# EasyEDA Pro project PCB_keyboard_V1_3_4.eprj

# Schematic PCB_keyboard
Board Name: PCB_keyboard; Create Date: 2025-07-02; Page Name: Sheet_1; Project Name: PCB_keyboard_V1_3_3; Schematic Name: PCB_keyboard; Update Date: 2025-07-06; Add into BOM: yes; Company: Your Company; Convert to PCB: yes; Date: 2025-05-16; REV: 1.0; Sheet: 1/1; spicePre: .
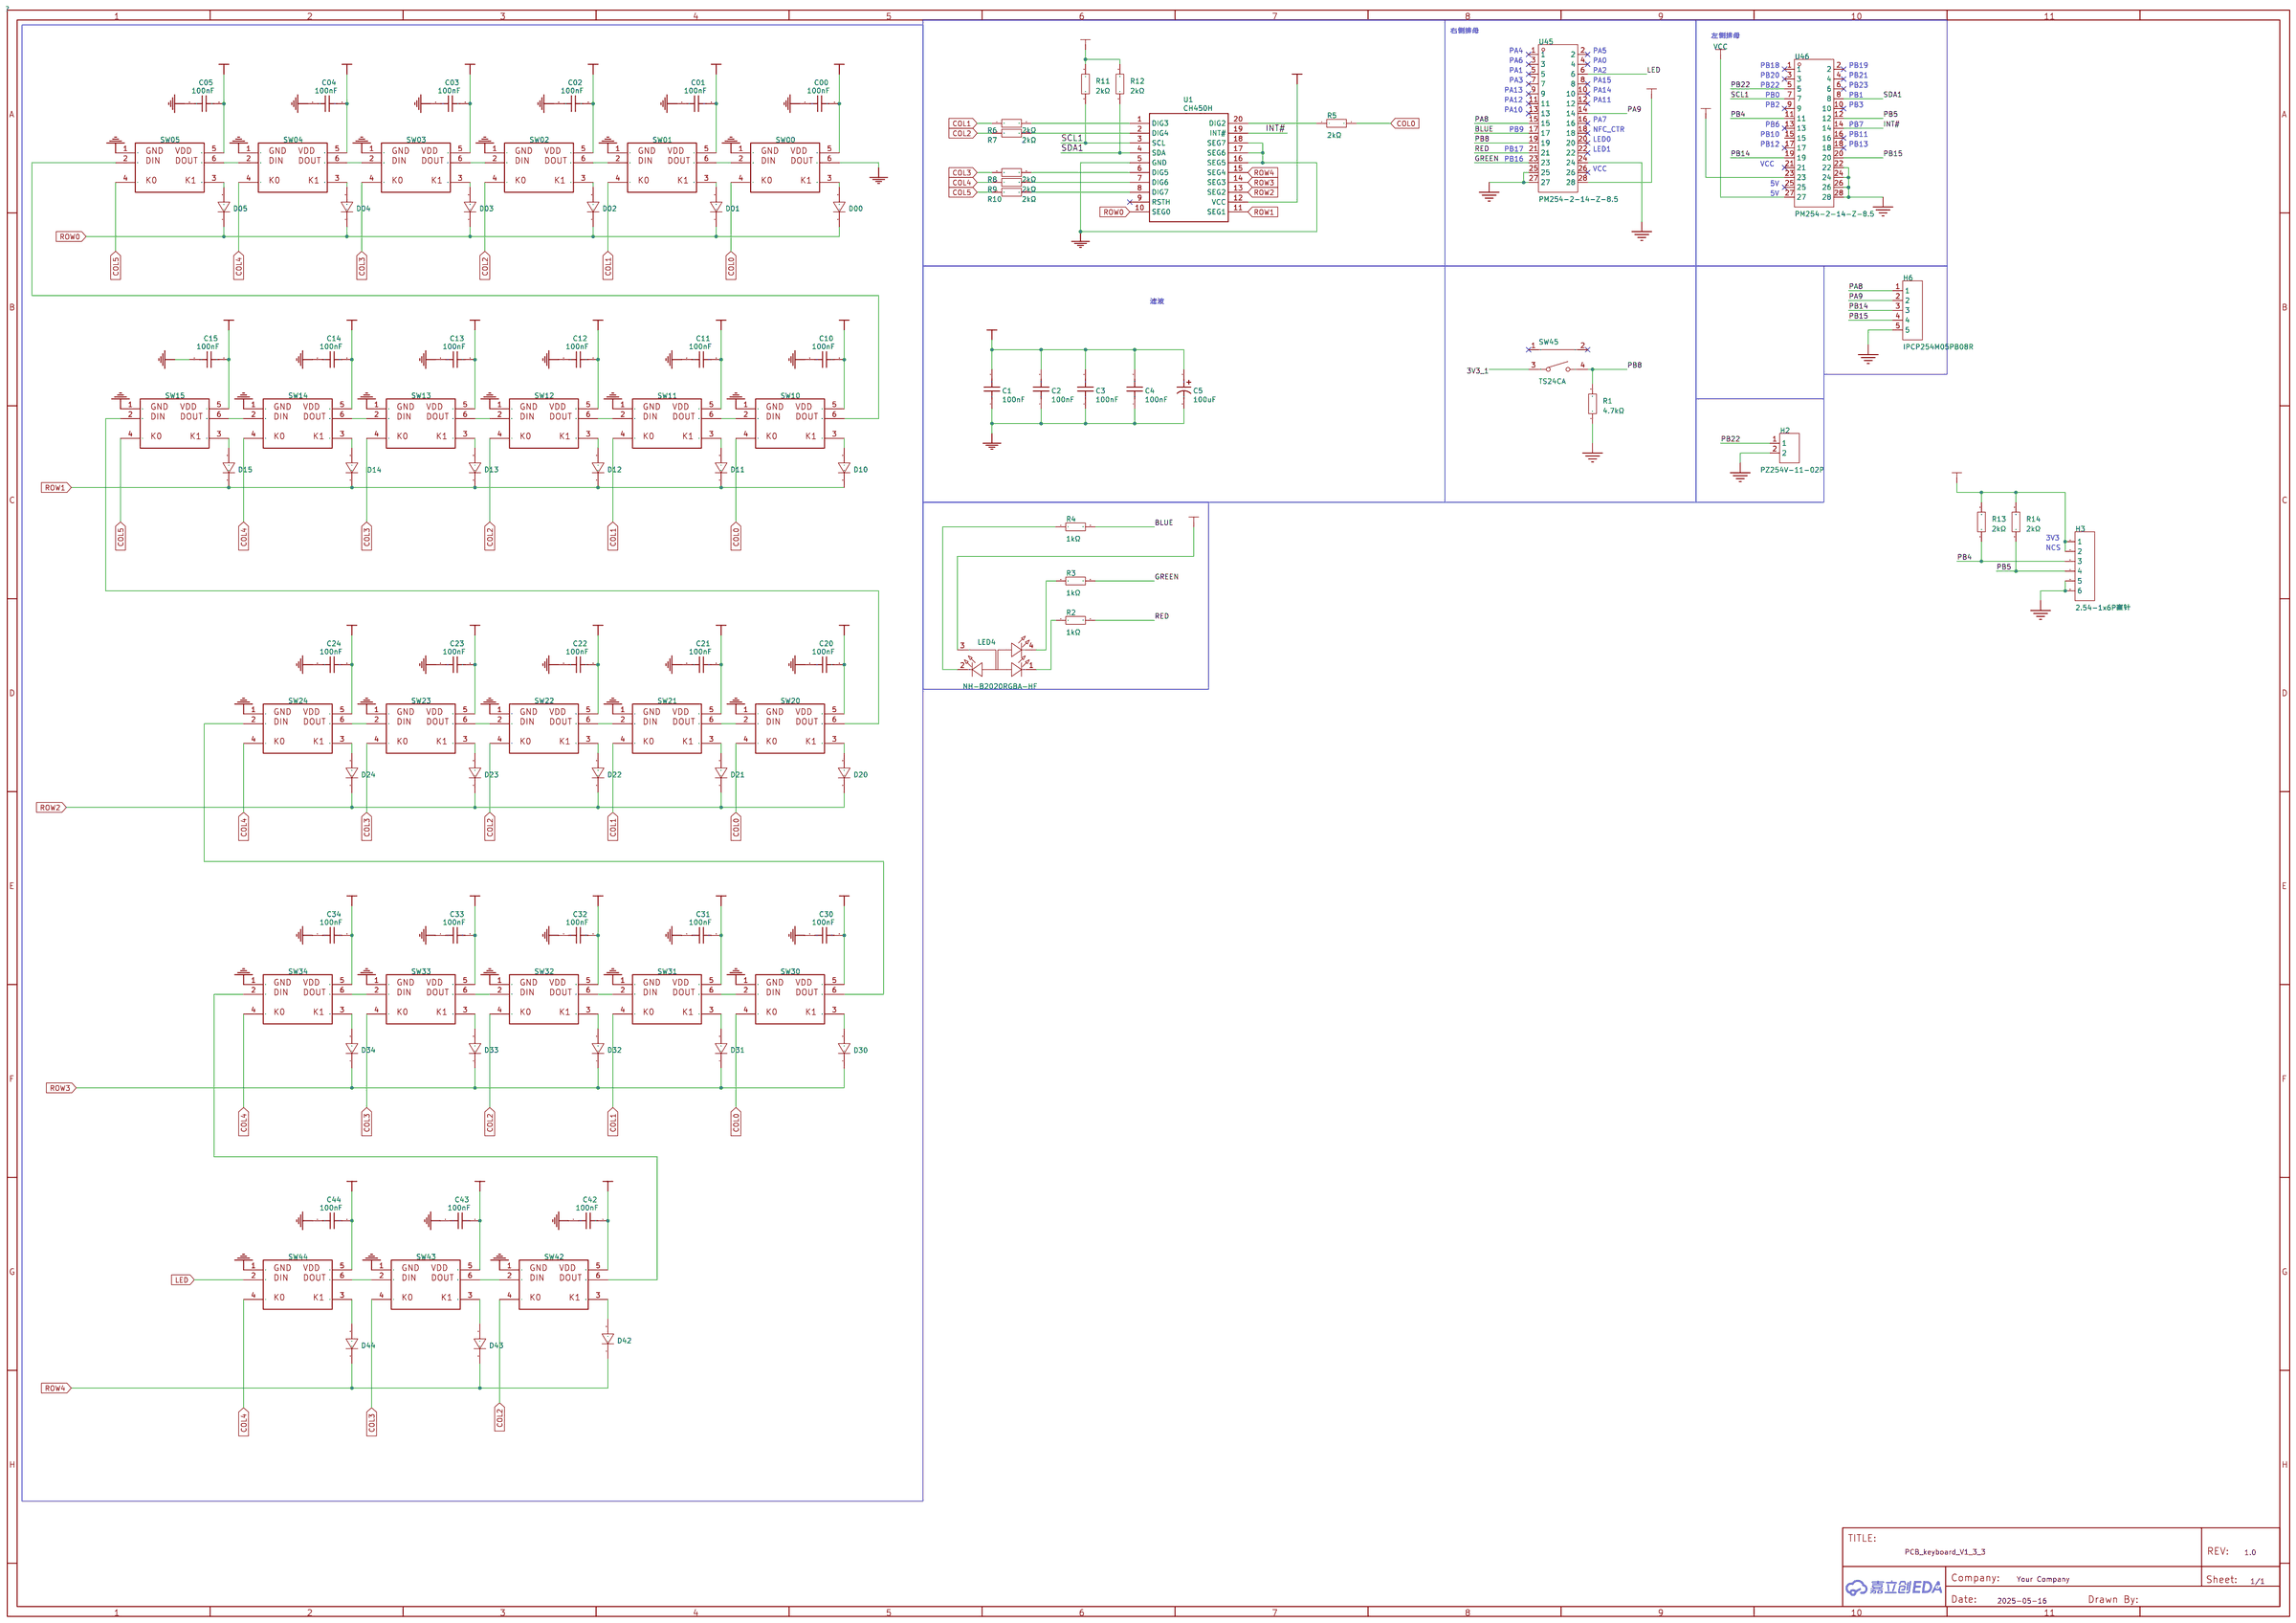
[diagram p0: schematic sheet]

## Parts
C00  100nF  [C0805]
C1  100nF  [C0805]
C01  100nF  [C0805]
C2  100nF  [C0805]
C02  100nF  [C0805]
C3  100nF  [C0805]
C03  100nF  [C0805]
C4  100nF  [C0805]
C04  100nF  [C0805]
C5  100uF  [CAP-TH_BD6.0-P2.50-D0.5-FD]
C05  100nF  [C0805]
C10  100nF  [C0805]
C11  100nF  [C0805]
C12  100nF  [C0805]
C13  100nF  [C0805]
C14  100nF  [C0805]
C15  100nF  [C0805]
C20  100nF  [C0805]
C21  100nF  [C0805]
C22  100nF  [C0805]
C23  100nF  [C0805]
C24  100nF  [C0805]
C30  100nF  [C0805]
C31  100nF  [C0805]
C32  100nF  [C0805]
C33  100nF  [C0805]
C34  100nF  [C0805]
C42  100nF  [C0805]
C43  100nF  [C0805]
C44  100nF  [C0805]
D00  1N4148W  [SOD-123_L2.8-W1.8-LS3.7-RD]
D01  1N4148W  [SOD-123_L2.8-W1.8-LS3.7-RD]
D02  1N4148W  [SOD-123_L2.8-W1.8-LS3.7-RD]
D03  1N4148W  [SOD-123_L2.8-W1.8-LS3.7-RD]
D04  1N4148W  [SOD-123_L2.8-W1.8-LS3.7-RD]
D05  1N4148W  [SOD-123_L2.8-W1.8-LS3.7-RD]
D10  1N4148W  [SOD-123_L2.8-W1.8-LS3.7-RD]
D11  1N4148W  [SOD-123_L2.8-W1.8-LS3.7-RD]
D12  1N4148W  [SOD-123_L2.8-W1.8-LS3.7-RD]
D13  1N4148W  [SOD-123_L2.8-W1.8-LS3.7-RD]
D14  1N4148W  [SOD-123_L2.8-W1.8-LS3.7-RD]
D15  1N4148W  [SOD-123_L2.8-W1.8-LS3.7-RD]
D20  1N4148W  [SOD-123_L2.8-W1.8-LS3.7-RD]
D21  1N4148W  [SOD-123_L2.8-W1.8-LS3.7-RD]
D22  1N4148W  [SOD-123_L2.8-W1.8-LS3.7-RD]
D23  1N4148W  [SOD-123_L2.8-W1.8-LS3.7-RD]
D24  1N4148W  [SOD-123_L2.8-W1.8-LS3.7-RD]
D30  1N4148W  [SOD-123_L2.8-W1.8-LS3.7-RD]
D31  1N4148W  [SOD-123_L2.8-W1.8-LS3.7-RD]
D32  1N4148W  [SOD-123_L2.8-W1.8-LS3.7-RD]
D33  1N4148W  [SOD-123_L2.8-W1.8-LS3.7-RD]
D34  1N4148W  [SOD-123_L2.8-W1.8-LS3.7-RD]
D42  1N4148W  [SOD-123_L2.8-W1.8-LS3.7-RD]
D43  1N4148W  [SOD-123_L2.8-W1.8-LS3.7-RD]
D44  1N4148W  [SOD-123_L2.8-W1.8-LS3.7-RD]
H2  PZ254V-11-02P  [HDR-TH_2P-P2.54-V-M]
H3  2.54-1x6P直针  [HDR-TH_6P-P2.54-V-M-1]
H6  IPCP254M05PB08R  [HDR-TH_IPCP254M05PB08R]
LED4  NH-B2020RGBA-HF  [LED-ARRAY-SMD_4P-L2.1-W2.1-TL_NH-B2020RGBA]
R1  4.7kΩ  [R0805]
R2  1kΩ  [R0805]
R3  1kΩ  [R0805]
R4  1kΩ  [R0805]
R5  2kΩ  [R0805]
R6  2kΩ  [R0805]
R7  2kΩ  [R0805]
R8  2kΩ  [R0805]
R9  2kΩ  [R0805]
R10  2kΩ  [R0805]
R11  2kΩ  [R0805]
R12  2kΩ  [R0805]
R13  2kΩ  [R0805]
R14  2kΩ  [R0805]
SW00  凯华轴座+3528反贴灯 COPY  [凯华轴座+3528反贴灯]
SW01  凯华轴座+3528反贴灯 COPY  [凯华轴座+3528反贴灯]
SW02  凯华轴座+3528反贴灯 COPY  [凯华轴座+3528反贴灯]
SW03  凯华轴座+3528反贴灯 COPY  [凯华轴座+3528反贴灯]
SW04  凯华轴座+3528反贴灯 COPY  [凯华轴座+3528反贴灯]
SW05  凯华轴座+3528反贴灯 COPY  [凯华轴座+3528反贴灯]
SW10  凯华轴座+3528反贴灯 COPY  [凯华轴座+3528反贴灯]
SW11  凯华轴座+3528反贴灯 COPY  [凯华轴座+3528反贴灯]
SW12  凯华轴座+3528反贴灯 COPY  [凯华轴座+3528反贴灯]
SW13  凯华轴座+3528反贴灯 COPY  [凯华轴座+3528反贴灯]
SW14  凯华轴座+3528反贴灯 COPY  [凯华轴座+3528反贴灯]
SW15  凯华轴座+3528反贴灯 COPY  [凯华轴座+3528反贴灯]
SW20  凯华轴座+3528反贴灯 COPY  [凯华轴座+3528反贴灯]
SW21  凯华轴座+3528反贴灯 COPY  [凯华轴座+3528反贴灯]
SW22  凯华轴座+3528反贴灯 COPY  [凯华轴座+3528反贴灯]
SW23  凯华轴座+3528反贴灯 COPY  [凯华轴座+3528反贴灯]
SW24  凯华轴座+3528反贴灯 COPY  [凯华轴座+3528反贴灯]
SW30  凯华轴座+3528反贴灯 COPY  [凯华轴座+3528反贴灯]
SW31  凯华轴座+3528反贴灯 COPY  [凯华轴座+3528反贴灯]
SW32  凯华轴座+3528反贴灯 COPY  [凯华轴座+3528反贴灯]
SW33  凯华轴座+3528反贴灯 COPY  [凯华轴座+3528反贴灯]
SW34  凯华轴座+3528反贴灯 COPY  [凯华轴座+3528反贴灯]
SW42  凯华轴座+3528反贴灯 COPY  [凯华轴座+3528反贴灯]
SW43  凯华轴座+3528反贴灯 COPY  [凯华轴座+3528反贴灯]
SW44  凯华轴座+3528反贴灯 COPY  [凯华轴座+3528反贴灯]
SW45  TS24CA  [SW-SMD_TS24CA]
U1  CH450H  [SOP-20_L12.7-W7.5-P1.27-LS10.3-BL]
U45  PM254-2-14-Z-8.5  [HDR-TH_28P-P2.54-V-F-R2-C14-S2.54-1]
U46  PM254-2-14-Z-8.5  [HDR-TH_28P-P2.54-V-F-R2-C14-S2.54-1]

## Library data of the parts
C00 C1 C01 C2 C02 C3 C03 C4 C04 C05 C10-C15 C20-C24 C30-C34 C42-C44 = FCC0805B104K500DT: 容值:100nF;精度:±10%;额定电压:50V;温度系数:X7R;; LCSC Part Name: 100nF ±10% 50V; Supplier Part: C5137467; Manufacturer: FOJAN(富捷); Supplier Footprint: 0805; JLCPCB Part Class: Extended Part; Datasheet: https://atta.szlcsc.com/upload/public/pdf/source/20220818/0EB3B7FB2F5648AC16609637FBA7DABE.pdf; Supplier: LCSC; Tolerance: ±10%; Voltage Rating: 50V; Temperature Coefficient: X7R
C5 = 100uF: Supplier: LCSC; Supplier Part: C2873969; Manufacturer: ROQANG(容强); Manufacturer Part: KM1E101M0611; link: https://so.szlcsc.com/global.html?k=C2873969&ref=editor; nameAlias: Value; Contributor: lcsc; spicePre: C; spiceSymbolName: KM1E101M0611
D00 D01 D02 D03 D04 D05 D10-D15 D20-D24 D30-D34 D42-D44 = 1N4148W_C2099: 二极管配置:独立式;正向压降(Vf):1.25V@150mA;直流反向耐压(Vr):100V;整流电流:150mA;反向恢复时间(trr):4ns;; LCSC Part Name: 丝印T4; Supplier Part: C2099; Manufacturer: CJ(江苏长电/长晶); Supplier Footprint: SOD-123; JLCPCB Part Class: Extended Part; Datasheet: https://atta.szlcsc.com/upload/public/pdf/source/20120428/1457706480199.pdf; Supplier: LCSC; Diode Configuration: 独立式; Forward Voltage (Vf@If): 1.25V@150mA; Reverse Voltage (Vr): 100V; Rectified Current: 150mA; Reverse Leakage Current: 1uA@75V; Reverse Recovery Time (trr): 4ns
H2 = PZ254V-11-02P: 插针结构:1x2P;间距:2.54mm;行距:-;圆针/方针:方针;安装方式:直插;排数:单排;总PIN位数:2P;额定电流:-;额定电压:-;配合针长度:6mm;塑高:2.5mm;端接针长度:3mm;触头材质:黄铜;触头镀层:-;工作温度:-40℃~+105℃;颜色:黑色;; LCSC Part Name: 1x2P 间距:2.54mm 方针 直插; Supplier Part: C492401; Manufacturer: XFCN(兴飞); Supplier Footprint: 插件,P=2.54mm; JLCPCB Part Class: 扩展库; Datasheet: https://atta.szlcsc.com/upload/public/pdf/source/20200309/C492401_A812433581A9B211A7FFA413ADDFF0E5.pdf; Supplier: LCSC; Pin Structure: 1x2P; Pitch: 2.54mm; Circluar Pins/Square Pins: 方针; Mounting Type: 直插; Number of Rows: 单排; Number of Pins: 2P; Length of Mating Pin: 6mm; Insulation Height: 2.5mm; Length of End Connection Pin: 3mm; Contact Material: 黄铜; Operating Temperature: -40℃~+105℃; Color: 黑色
H3 = 2.54-1x6P直针: 插针结构:1x6P;间距:2.54mm;行距:-;圆针/方针:方针;安装方式:直插;排数:单排;总PIN位数:6P;额定电流:3A;额定电压:-;配合针长度:-;塑高:-;触头材质:黄铜;触头镀层:-;工作温度:-40℃~+105℃;颜色:黑色;; LCSC Part Name: 1x6P 间距:2.54mm 方针 直插; Supplier Part: C37208; Manufacturer: BOOMELE(博穆精密); Supplier Footprint: 插件,P=2.54mm; JLCPCB Part Class: 扩展库; Datasheet: https://atta.szlcsc.com/upload/public/pdf/source/20250115/42A019761A40C8B839643401D8CA5A96.pdf; Supplier: LCSC; Pin Structure: 1x6P; Pitch: 2.54mm; Circluar Pins/Square Pins: 方针; Mounting Type: 直插; Number of Rows: 单排; Number of Pins: 6P; Current Rating: 3A; Contact Material: 黄铜; Operating Temperature: -40℃~+105℃; Color: 黑色
H6 = IPCP254M05PB08R: 插针结构:1x5P;间距:2.54mm;圆针/方针:方针;安装方式:弯插;排数:单排;总PIN位数:5P;额定电流:3A;额定电压:-;塑高:2.5mm;触头材质:黄铜;触头镀层:金;工作温度:-40℃~+105℃;颜色:黑色;; LCSC Part Name: 1x5P 间距:2.54mm 方针 弯插; Supplier Part: C22395595; Manufacturer: INCP; Supplier Footprint: 弯插,P=2.54mm; JLCPCB Part Class: 扩展库; Datasheet: https://atta.szlcsc.com/upload/public/pdf/source/20250208/975C7ED3E6965D9726D213BB1A1DEC82.pdf; Supplier: LCSC; Pin Structure: 1x5P; Pitch: 2.54mm; Circluar Pins/Square Pins: 方针; Mounting Type: 弯插; Number of Rows: 单排; Number of Pins: 5P; Current Rating: 3A; Insulation Height: 2.5mm; Contact Material: 黄铜; Contact Plating: 金; Operating Temperature: -40℃~+105℃; Color: 黑色
LED4 = NH-B2020RGBA-HF: 黑色哑光户外RGB; Supplier Part: C2874116; Manufacturer: 国星光电; Supplier Footprint: SMD,2.1x2.1mm; JLCPCB Part Class: 扩展库; Datasheet: https://atta.szlcsc.com/upload/public/pdf/source/20210810/F2CC95523506BC87574AF0308E7F77A3.pdf; Supplier: LCSC; Diode Configuration: 共阳极; Dominant Wavelength: G:525nm；R:622nm；B:468nm; Luminous Intensity: R:45mcd；G:160mcd；B:25mcd; Viewing Angle: 110°; Forward Current: R:8mA；G:5mA；B:3mA; Forward Voltage: R:2V；G:2.7V；B:2.8V; Installation Method: 正贴; Operating Temperature: -30℃~+85℃
R1 = 0805W8F4701T5E: 电阻类型:厚膜电阻;阻值:4.7kΩ;精度:±1%;功率:125mW;最大工作电压:150V;温度系数:±100ppm/℃;; LCSC Part Name: 4.7kΩ ±1% 125mW 厚膜电阻; Supplier Part: C17673; Manufacturer: UNI-ROYAL(厚声); Supplier Footprint: 0805; JLCPCB Part Class: Basic Part; Datasheet: https://atta.szlcsc.com/upload/public/pdf/source/20200306/C422600_1E6D84923E4A46A82E41ADD87F860B5C.pdf; Supplier: LCSC; Type: 厚膜电阻; Tolerance: ±1%; Power(Watts): 125mW; Overload Voltage (Max): 150V; Temperature Coefficient: ±100ppm/℃; Operating Temperature Range: -55℃~+155℃
R2-R4 = 0805W8F1001T5E: 电阻类型:厚膜电阻;阻值:1kΩ;精度:±1%;功率:125mW;最大工作电压:150V;温度系数:±100ppm/℃;; LCSC Part Name: 1kΩ ±1% 125mW 厚膜电阻; Supplier Part: C17513; Manufacturer: UNI-ROYAL(厚声); Supplier Footprint: 0805; JLCPCB Part Class: Basic Part; Datasheet: https://atta.szlcsc.com/upload/public/pdf/source/20200306/C422600_1E6D84923E4A46A82E41ADD87F860B5C.pdf; Supplier: LCSC; Type: 厚膜电阻; Tolerance: ±1%; Power(Watts): 125mW; Overload Voltage (Max): 150V; Temperature Coefficient: ±100ppm/℃; Operating Temperature Range: -55℃~+155℃
R5-R14 = 0805W8F2001T5E: 电阻类型:厚膜电阻;阻值:2kΩ;精度:±1%;功率:125mW;最大工作电压:150V;温度系数:±100ppm/℃;; LCSC Part Name: 2kΩ ±1% 125mW 厚膜电阻; Supplier Part: C17604; Manufacturer: UNI-ROYAL(厚声); Supplier Footprint: 0805; JLCPCB Part Class: 基础库; Datasheet: https://atta.szlcsc.com/upload/public/pdf/source/20200306/C422600_1E6D84923E4A46A82E41ADD87F860B5C.pdf; Supplier: LCSC; Type: 厚膜电阻; Tolerance: ±1%; Power(Watts): 125mW; Overload Voltage (Max): 150V; Temperature Coefficient: ±100ppm/℃; Operating Temperature Range: -55℃~+155℃
SW00 SW01 SW02 SW03 SW04 SW05 SW10-SW15 SW20-SW24 SW30-SW34 SW42-SW44 = 凯华轴座+3528反贴灯 COPY
SW45 = TS24CA: 电路结构:单刀单掷;按钮形状:矩形按钮;安装方式:卧贴;开关长度:4.55mm;开关宽度:1.8mm;开关高度:3.5mm;触点电流:50mA;额定电压(DC):12V;带灯:-;机械寿命:-;; LCSC Part Name: 4.55*1.8*3.5mm 卧贴 轻触开关; Supplier Part: C393942; Manufacturer: SHOU HAN(首韩); Supplier Footprint: SMD; JLCPCB Part Class: 扩展库; Datasheet: https://atta.szlcsc.com/upload/public/pdf/source/20190521/C393942_591A9E318887EFA4274D34029981AD99.pdf; Supplier: LCSC; Circuit: 单刀单掷; Actuator Style: 矩形按钮; Mounting Style: 卧贴; Switch Length: 4.55mm; Switch Width: 1.8mm; Switch Height: 3.5mm; Contact Current: 50mA; Voltage Rating (DC): 12V
U1 = CH450H: Supplier: LCSC; Manufacturer: WCH(南京沁恒); Supplier Part: C56245; JLCPCB Part Class: Extended Part; spicePre: U
U45 U46 = PM254-2-14-Z-8.5: 插孔结构:2x14P;间距:2.54mm;行距:2.54mm;圆孔/方孔:方孔;安装类型:直插;排数:双排;总孔位数:28P;额定电流:3A;额定电压:-;插孔方向:顶部;塑高:8.5mm;触头材质:铜合金;工作温度范围:-40℃~+105℃;焊接温度(最大值):260℃@5S;; LCSC Part Name: 2x14P 间距:2.54mm 直插; Supplier Part: C2897415; Manufacturer: HCTL(华灿天禄); Supplier Footprint: 插件,P=2.54mm; JLCPCB Part Class: 扩展库; Datasheet: https://atta.szlcsc.com/upload/public/pdf/source/20230609/3D36CA2C1BFC9FD1C3F709AD9DFEB9C2.pdf; Supplier: LCSC; Holes Structure: 2x14P; Pitch: 2.54mm; Row Spacing: 2.54mm; Circular Hole / Square Hole: 方孔; Mounting Type: 直插; Number of Rows: 双排; Number of Holes: 28P; Current Rating (Max): 3A; Holes Direction: 顶部; Insulation Height: 8.5mm; Contact Material: 铜合金; Operating Temperature Range: -40℃~+105℃; Soldering Temperature(Max): 260℃@5S

## Nets
3V3_1: LED4.3(+) SW45.3 U45.28
3V3_2: H3.1 H3.2 R11.2 R12.2 R13.2 R14.2 U46.23
GND: C00.1 C1.1 C01.1 C2.1 C02.1 C3.1 C03.1 C4.1 C04.1 C05.1 C5.2 C10.1 C11.1 C12.1 C13.1 C14.1 C15.1 C20.1 C21.1 C22.1 C23.1 C24.1 C30.1 C31.1 C32.1 C33.1 C34.1 C42.1 C43.1 C44.1 H2.2 H3.5 H3.6 H6.5 R1.1 SW00.1 SW00.6 SW01.1 SW02.1 SW03.1 SW04.1 SW05.1 SW10.1 SW11.1 SW12.1 SW13.1 SW14.1 SW15.1 SW20.1 SW21.1 SW22.1 SW23.1 SW24.1 SW30.1 SW31.1 SW32.1 SW33.1 SW34.1 SW42.1 SW43.1 SW44.1 U1.5(GND) U1.16(SEG5) U1.17(SEG6) U1.18(SEG7) U45.24 U45.25 U45.27 U46.22 U46.24 U46.26 U46.28
VCC: C00.2 C1.2 C01.2 C2.2 C02.2 C3.2 C03.2 C4.2 C04.2 C5.1 C05.2 C10.2 C11.2 C12.2 C13.2 C14.2 C15.2 C20.2 C21.2 C22.2 C23.2 C24.2 C30.2 C31.2 C32.2 C33.2 C34.2 C42.2 C43.2 C44.2 SW00.5 SW01.5 SW02.5 SW03.5 SW04.5 SW05.5 SW10.5 SW11.5 SW12.5 SW13.5 SW14.5 SW15.5 SW20.5 SW21.5 SW22.5 SW23.5 SW24.5 SW30.5 SW31.5 SW32.5 SW33.5 SW34.5 SW42.5 SW43.5 SW44.5 U1.12(VCC) U46.27
BLUE: R4.2 U45.17
COL0: R5.2 SW00.4 SW10.4 SW20.4 SW30.4
COL1: R6.1 SW01.4 SW11.4 SW21.4 SW31.4
COL2: R7.1 SW02.4 SW12.4 SW22.4 SW32.4 SW42.4
COL3: R8.1 SW03.4 SW13.4 SW23.4 SW33.4 SW43.4
COL4: R9.1 SW04.4 SW14.4 SW24.4 SW34.4 SW44.4
COL5: R10.1 SW05.4 SW15.4
GREEN: R3.2 U45.23
INT#: U1.19(INT#) U46.14
LED: SW44.2 U45.6
PA8: H6.1 U45.15
PA9: H6.2 U45.14
PB4: H3.3 R13.1 U46.11
PB5: H3.4 R14.1 U46.12
PB8: R1.2 SW45.4 U45.19
PB14: H6.3 U46.19
PB15: H6.4 U46.20
PB22: H2.1 U46.5
RED: R2.2 U45.21
ROW0: D00.1(K) D01.1(K) D02.1(K) D03.1(K) D04.1(K) D05.1(K) U1.10(SEG0)
ROW1: D10.1(K) D11.1(K) D12.1(K) D13.1(K) D14.1(K) D15.1(K) U1.11(SEG1)
ROW2: D20.1(K) D21.1(K) D22.1(K) D23.1(K) D24.1(K) U1.13(SEG2)
ROW3: D30.1(K) D31.1(K) D32.1(K) D33.1(K) D34.1(K) U1.14(SEG3)
ROW4: D42.1(K) D43.1(K) D44.1(K) U1.15(SEG4)
SCL1: R11.1 U1.3(SCL) U46.7
SDA1: R12.1 U1.4(SDA) U46.8
$1N69: D00.2(A) SW00.3
$1N70: D01.2(A) SW01.3
$1N71: D02.2(A) SW02.3
$1N72: D03.2(A) SW03.3
$1N73: D04.2(A) SW04.3
$1N74: D05.2(A) SW05.3
$1N77: D10.2(A) SW10.3
$1N78: D11.2(A) SW11.3
$1N79: D12.2(A) SW12.3
$1N80: D13.2(A) SW13.3
$1N81: D14.2(A) SW14.3
$1N82: D15.2(A) SW15.3
$1N83: D20.2(A) SW20.3
$1N84: D21.2(A) SW21.3
$1N85: D22.2(A) SW22.3
$1N86: D23.2(A) SW23.3
$1N87: D24.2(A) SW24.3
$1N90: D30.2(A) SW30.3
$1N91: D31.2(A) SW31.3
$1N92: D32.2(A) SW32.3
$1N95: D33.2(A) SW33.3
$1N97: D34.2(A) SW34.3
$1N99: D42.2(A) SW42.3
$1N100: D43.2(A) SW43.3
$1N101: D44.2(A) SW44.3
$1N102: SW42.2 SW43.6
$1N103: SW43.2 SW44.6
$1N108: SW34.2 SW42.6
$1N109: SW33.2 SW34.6
$1N110: SW32.2 SW33.6
$1N111: SW31.2 SW32.6
$1N112: SW30.2 SW31.6
$1N113: SW24.2 SW30.6
$1N114: SW23.2 SW24.6
$1N115: SW22.2 SW23.6
$1N116: SW21.2 SW22.6
$1N117: SW20.2 SW21.6
$1N118: SW15.2 SW20.6
$1N119: SW14.2 SW15.6
$1N120: SW13.2 SW14.6
$1N121: SW12.2 SW13.6
$1N122: SW11.2 SW12.6
$1N123: SW10.2 SW11.6
$1N125: SW04.2 SW05.6
$1N126: SW03.2 SW04.6
$1N127: SW02.2 SW03.6
$1N128: SW01.2 SW02.6
$1N129: SW00.2 SW01.6
$1N130: SW05.2 SW10.6
$1N70752: R5.1 U1.20(DIG2)
$1N70795: R6.2 U1.1(DIG3)
$1N70838: R7.2 U1.2(DIG4)
$1N70881: R8.2 U1.6(DIG5)
$1N70924: R9.2 U1.7(DIG6)
$1N70967: R10.2 U1.8(DIG7)
$1N82980: LED4.1(-) R2.1
$1N82986: LED4.4(-) R3.1
$1N82993: LED4.2(-) R4.1

Not connected (* = marked no-connect by the designer): SW45 1* 2*; U1 9(RSTH)*; U45 1* 2* 3* 4* 5* 7* 8* 9* 10* 11* 12* 13* 16* 18* 20* 22* 26*; U46 1* 2* 3* 4* 6* 9* 10* 13* 15 16* 17* 18* 21* 25*

## Notes on the sheet
- 右侧排母
- 左侧排母
- PA4
- PA5
- PA6
- PA0
- PB18
- PB19
- PA1
- PA3
- PA15
- PA2
- PB20
- PB21
- PA13
- PA14
- PB22
- PB23
- PA12
- PA11
- PB0
- PB2
- PB1
- PB3
- PA10
- PA7
- PB6
- PB7
- PB9
- LED0
- NFC_CTR
- PB10
- PB11
- PB17
- LED1
- PB12
- PB13
- PB16
- VCC
- VCC
- 5V
- 5V
- 滤波
- 3V3
- NCS

# Board PCB_PCB_keyboard
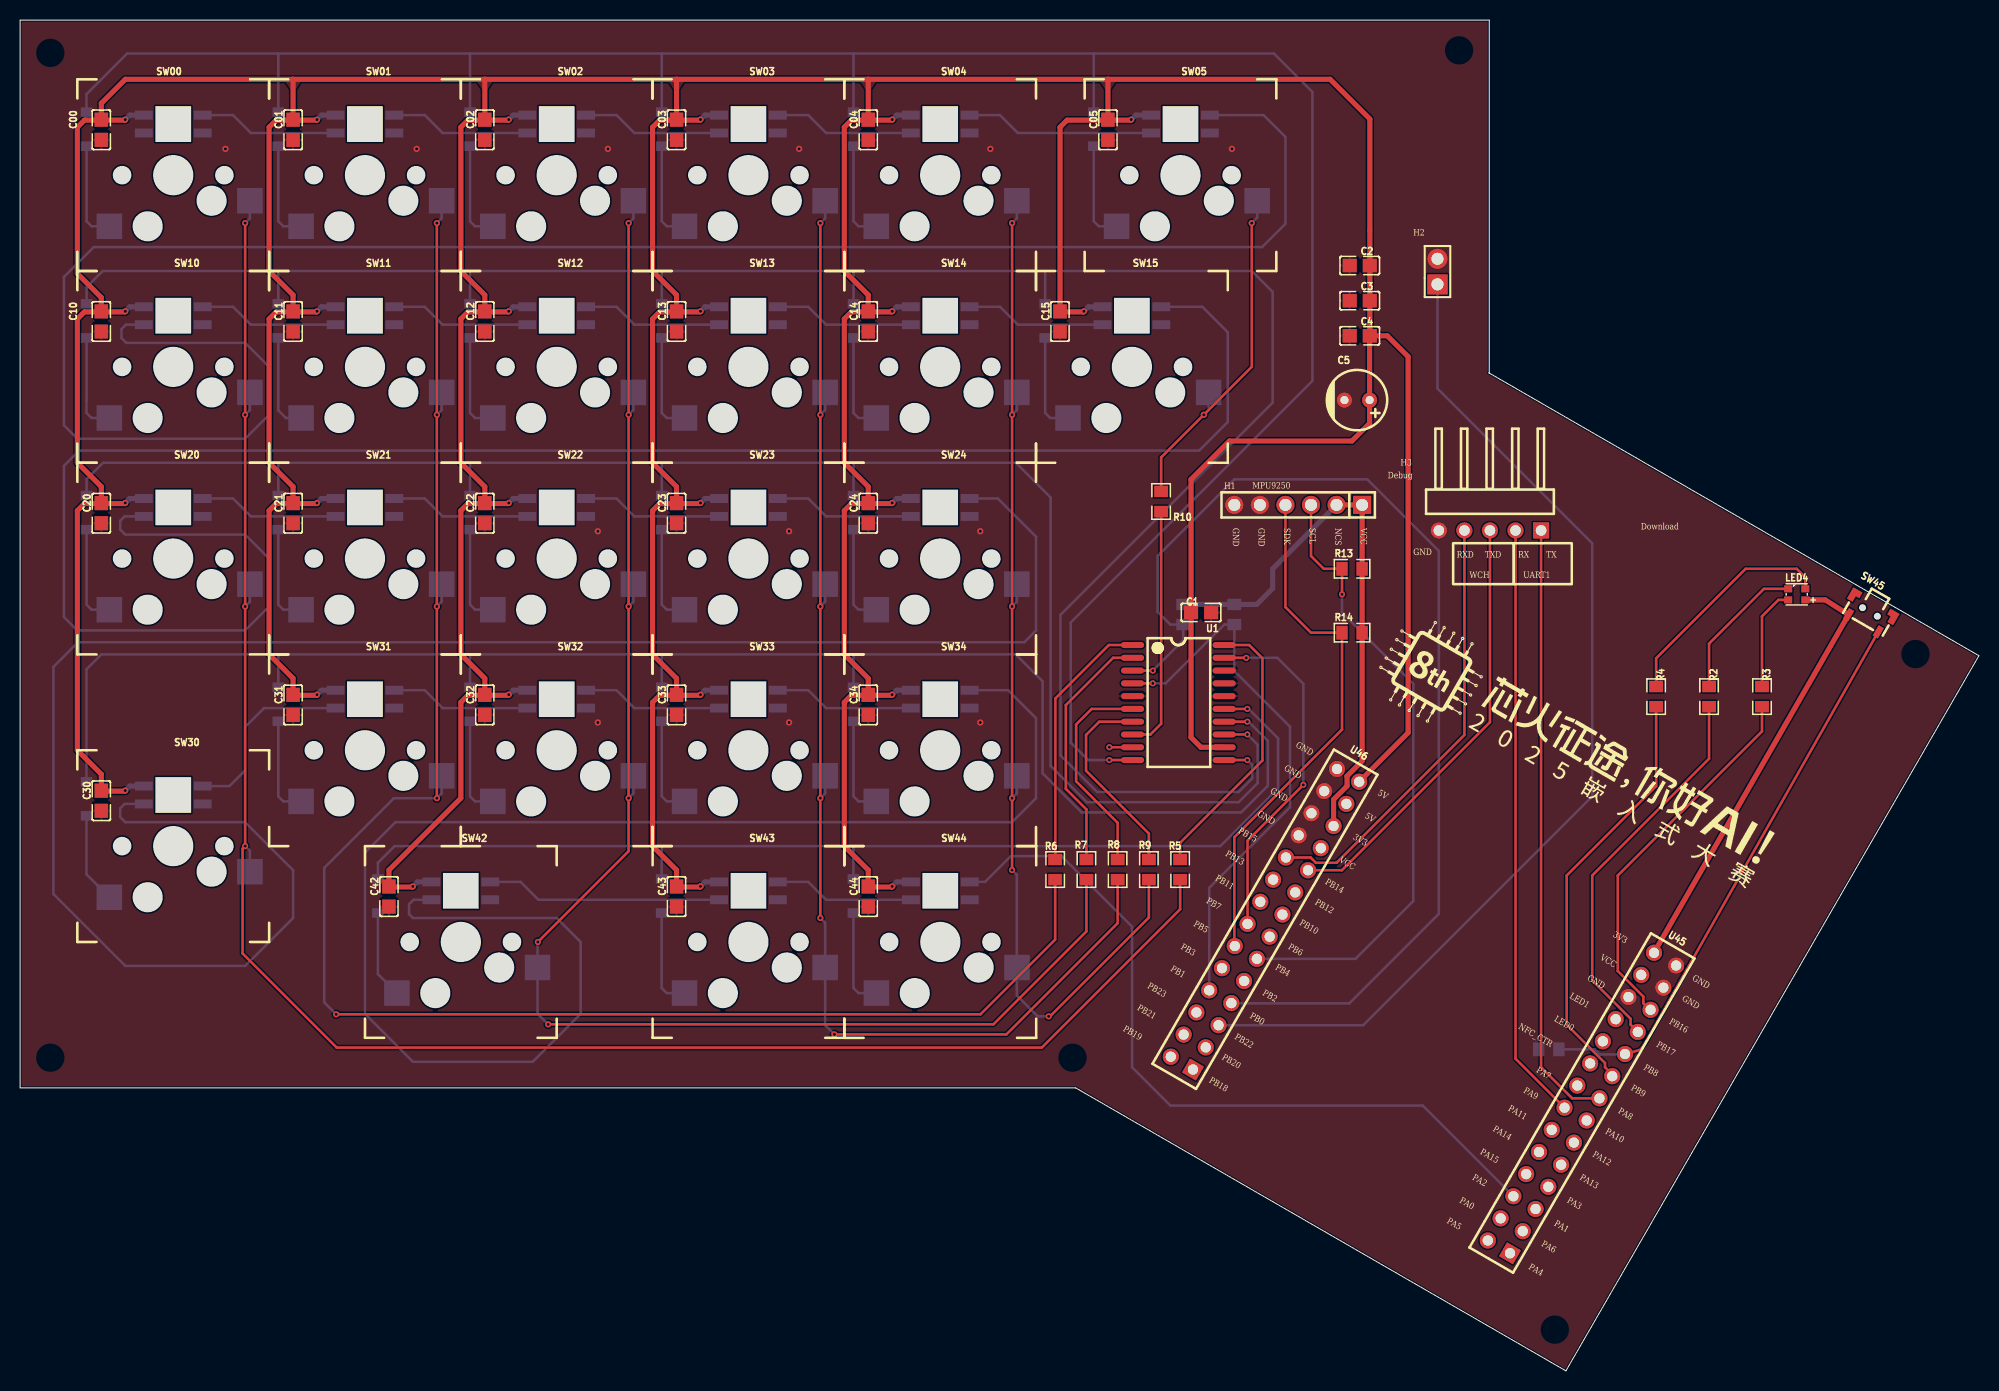
[diagram p1: board, top side]
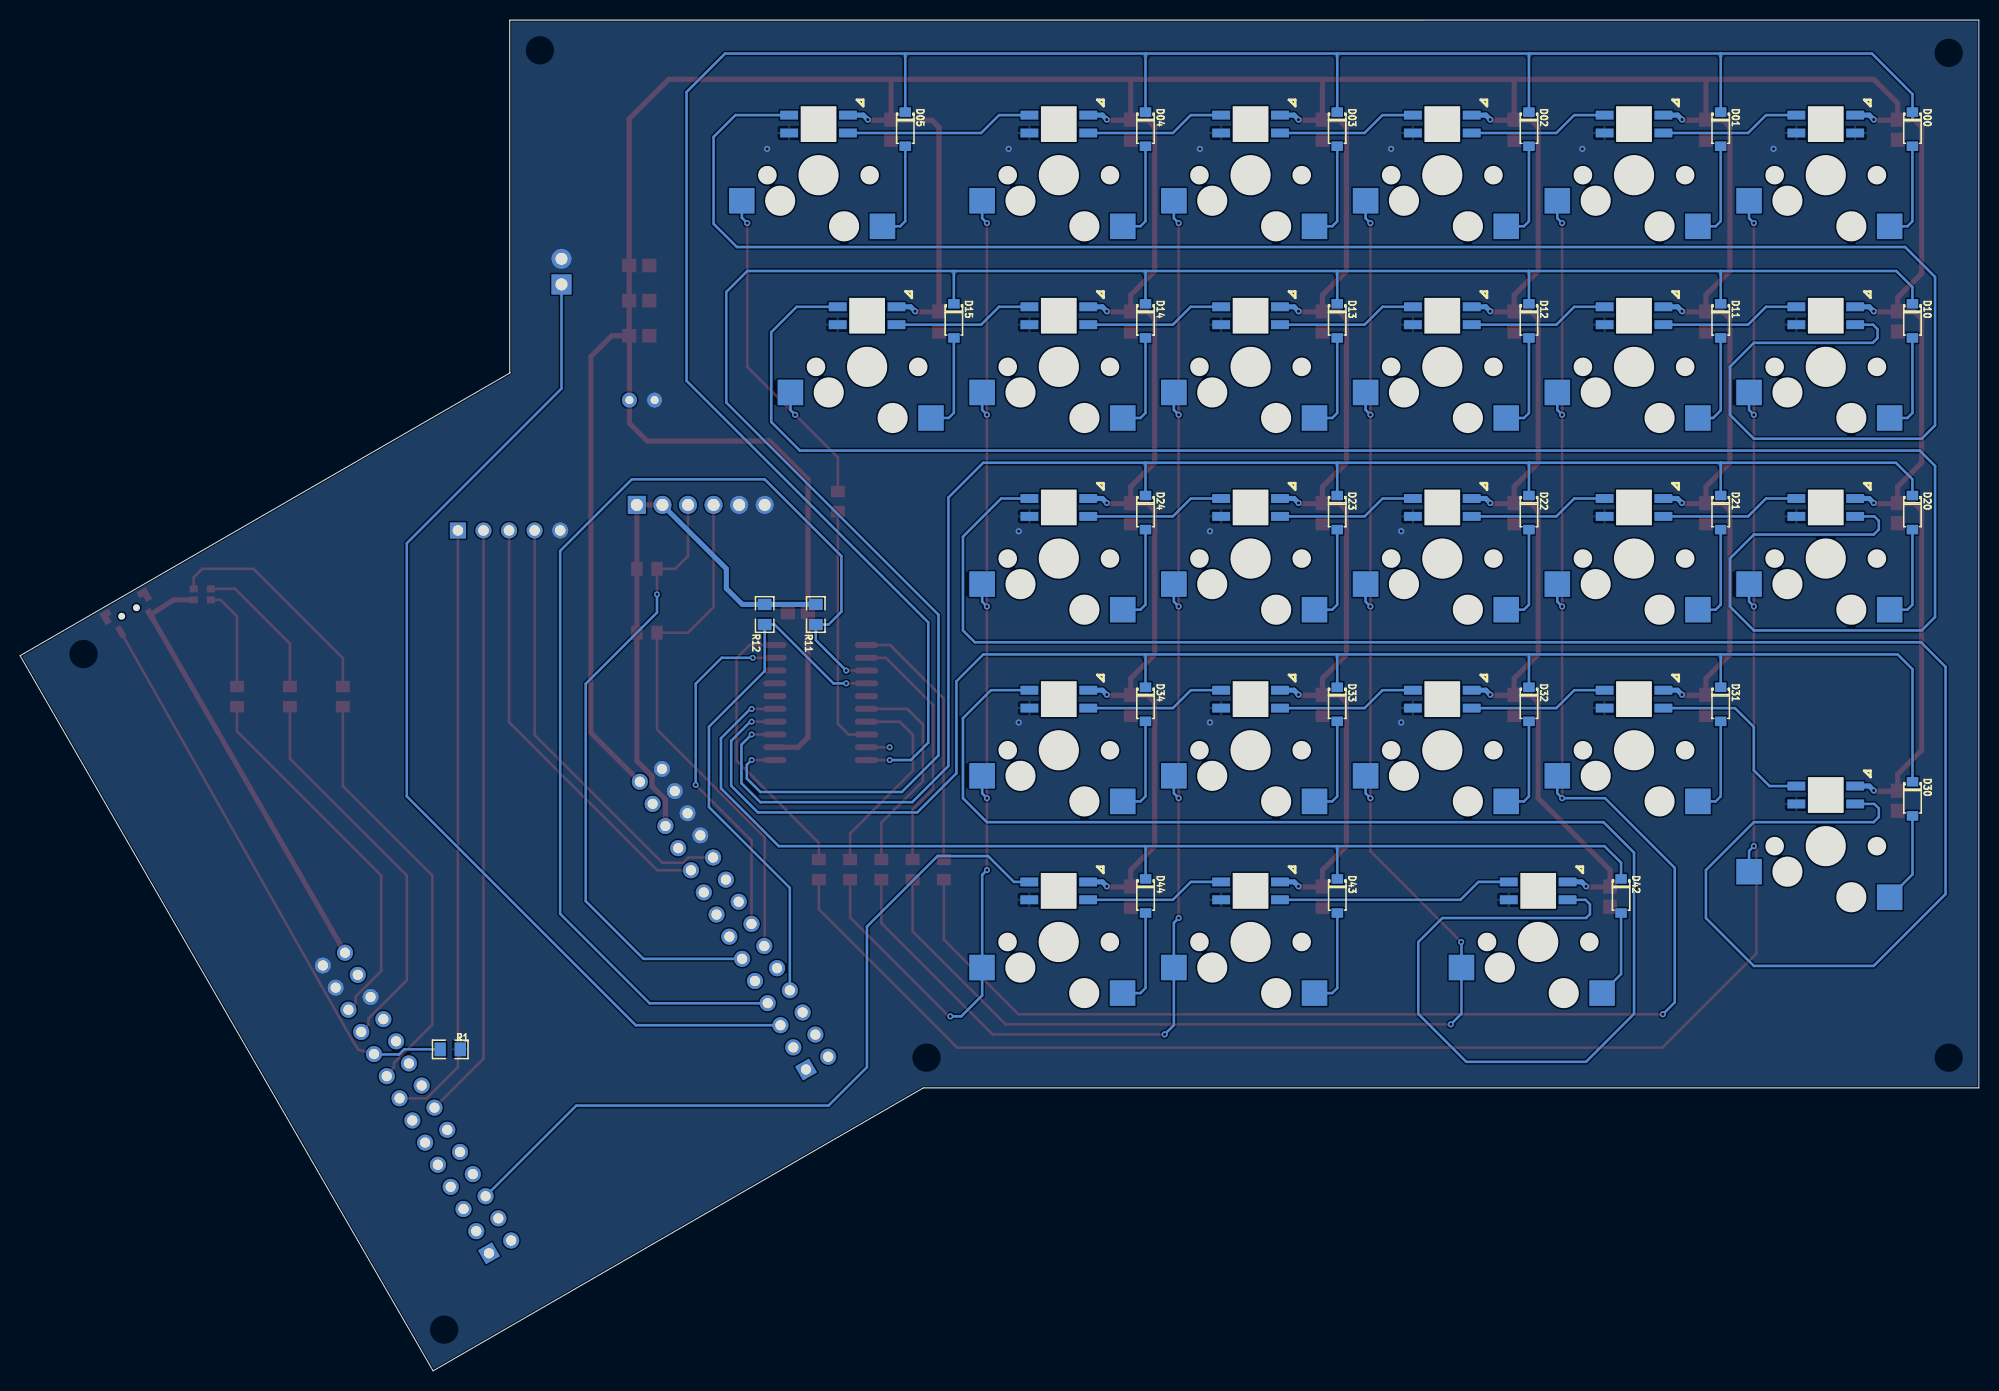
[diagram p2: board, bottom side, seen from below]

Outline 194.62 x 134.23 mm; copper layers: Top Layer, Bottom Layer. Coordinates in mm from the lower left corner of the outline.
Outline path: 145.97,99.15 145.9,99.19 ; 145.97,99.15 145.97,134.23 0,134.23 0,28.12 104.87,28.12 153.58,0 194.62,71.07 145.97,99.15
Stack: Top Layer 0.035mm / Dielectric1 1.51mm FR4 er 4.5 / Bottom Layer 0.035mm

## Design rules (mm)
spacing Default (default): track to track 0.152, other pairs 0 to 0.152
track width Default (default): min 0.254, default 0.254, max 25.4
differential pair differentialPair (default): width min 0.127, default 0.254, max 2.54; gap min 0.152, default 0.152
via Default (default): diameter min 0.61, default 0.61, max 100.025; hole min 0.305, default 0.305, max 59.995

## Placement (name value [footprint] x y rotation side)
C00  100nF  [C0805]  8.07 123.33 90 top
C01  100nF  [C0805]  27.12 123.33 90 top
C1  100nF  [C0805]  117.34 75.36 180 top
C02  100nF  [C0805]  46.17 123.33 90 top
C2  100nF  [C0805]  133.1 109.84 0 top
C03  100nF  [C0805]  65.22 123.33 90 top
C3  100nF  [C0805]  133.1 106.35 0 top
C04  100nF  [C0805]  84.27 123.33 90 top
C4  100nF  [C0805]  133.1 102.86 0 top
C05  100nF  [C0805]  108.08 123.33 90 top
C5  100uF  [CAP-TH_BD6.0-P2.50-D0.5-FD]  132.83 96.47 180 top
C10  100nF  [C0805]  8.07 104.28 90 top
C11  100nF  [C0805]  27.12 104.28 90 top
C12  100nF  [C0805]  46.17 104.28 90 top
C13  100nF  [C0805]  65.22 104.28 90 top
C14  100nF  [C0805]  84.27 104.28 90 top
C15  100nF  [C0805]  103.32 104.28 90 top
C20  100nF  [C0805]  8.07 85.23 90 top
C21  100nF  [C0805]  27.12 85.23 90 top
C22  100nF  [C0805]  46.17 85.23 90 top
C23  100nF  [C0805]  65.22 85.23 90 top
C24  100nF  [C0805]  84.27 85.23 90 top
C30  100nF  [C0805]  8.07 56.66 90 top
C31  100nF  [C0805]  27.12 66.18 90 top
C32  100nF  [C0805]  46.17 66.18 90 top
C33  100nF  [C0805]  65.22 66.18 90 top
C34  100nF  [C0805]  84.27 66.18 90 top
C42  100nF  [C0805]  36.64 47.13 90 top
C43  100nF  [C0805]  65.22 47.13 90 top
C44  100nF  [C0805]  84.27 47.13 90 top
D00  1N4148W  [SOD-123_L2.8-W1.8-LS3.7-RD]  6.6 123.39 270 bottom
D01  1N4148W  [SOD-123_L2.8-W1.8-LS3.7-RD]  25.65 123.39 270 bottom
D02  1N4148W  [SOD-123_L2.8-W1.8-LS3.7-RD]  44.7 123.39 270 bottom
D03  1N4148W  [SOD-123_L2.8-W1.8-LS3.7-RD]  63.75 123.39 270 bottom
D04  1N4148W  [SOD-123_L2.8-W1.8-LS3.7-RD]  82.8 123.39 270 bottom
D05  1N4148W  [SOD-123_L2.8-W1.8-LS3.7-RD]  106.67 123.39 270 bottom
D10  1N4148W  [SOD-123_L2.8-W1.8-LS3.7-RD]  6.6 104.34 270 bottom
D11  1N4148W  [SOD-123_L2.8-W1.8-LS3.7-RD]  25.65 104.34 270 bottom
D12  1N4148W  [SOD-123_L2.8-W1.8-LS3.7-RD]  44.7 104.34 270 bottom
D13  1N4148W  [SOD-123_L2.8-W1.8-LS3.7-RD]  63.75 104.34 270 bottom
D14  1N4148W  [SOD-123_L2.8-W1.8-LS3.7-RD]  82.8 104.34 270 bottom
D15  1N4148W  [SOD-123_L2.8-W1.8-LS3.7-RD]  101.84 104.34 270 bottom
D20  1N4148W  [SOD-123_L2.8-W1.8-LS3.7-RD]  6.6 85.29 270 bottom
D21  1N4148W  [SOD-123_L2.8-W1.8-LS3.7-RD]  25.65 85.29 270 bottom
D22  1N4148W  [SOD-123_L2.8-W1.8-LS3.7-RD]  44.7 85.29 270 bottom
D23  1N4148W  [SOD-123_L2.8-W1.8-LS3.7-RD]  63.75 85.29 270 bottom
D24  1N4148W  [SOD-123_L2.8-W1.8-LS3.7-RD]  82.8 85.29 270 bottom
D30  1N4148W  [SOD-123_L2.8-W1.8-LS3.7-RD]  6.59 56.84 270 bottom
D31  1N4148W  [SOD-123_L2.8-W1.8-LS3.7-RD]  25.65 66.24 270 bottom
D32  1N4148W  [SOD-123_L2.8-W1.8-LS3.7-RD]  44.7 66.24 270 bottom
D33  1N4148W  [SOD-123_L2.8-W1.8-LS3.7-RD]  63.75 66.24 270 bottom
D34  1N4148W  [SOD-123_L2.8-W1.8-LS3.7-RD]  82.8 66.24 270 bottom
D42  1N4148W  [SOD-123_L2.8-W1.8-LS3.7-RD]  35.55 47.19 270 bottom
D43  1N4148W  [SOD-123_L2.8-W1.8-LS3.7-RD]  63.74 47.19 270 bottom
D44  1N4148W  [SOD-123_L2.8-W1.8-LS3.7-RD]  82.79 47.19 270 bottom
H2  PZ254V-11-02P  [HDR-TH_2P-P2.54-V-M]  140.82 109.24 90 top
H3  2.54-1x6P直针  [HDR-TH_6P-P2.54-V-M-1]  126.99 86.05 180 top
H6  IPCP254M05PB08R  [HDR-TH_IPCP254M05PB08R]  146.04 83.51 180 top
LED4  NH-B2020RGBA-HF  [LED-ARRAY-SMD_4P-L2.1-W2.1-TL_NH-B2020RGBA]  176.52 77.16 0 top
R1  4.7kΩ  [R0805]  151.88 31.95 0 bottom
R2  1kΩ  [R0805]  167.81 67 270 top
R3  1kΩ  [R0805]  173.07 67 270 top
R4  1kΩ  [R0805]  162.55 67 270 top
R5  2kΩ  [R0805]  115.25 49.82 270 top
R6  2kΩ  [R0805]  102.84 49.82 90 top
R7  2kΩ  [R0805]  105.94 49.82 90 top
R8  2kΩ  [R0805]  109.05 49.82 90 top
R9  2kΩ  [R0805]  112.15 49.82 90 top
R10  2kΩ  [R0805]  113.37 86.39 270 top
R11  2kΩ  [R0805]  115.56 75.16 90 bottom
R12  2kΩ  [R0805]  120.64 75.16 90 bottom
R13  2kΩ  [R0805]  132.34 79.7 0 top
R14  2kΩ  [R0805]  132.34 73.35 0 top
SW00  凯华轴座+3528反贴灯 COPY  [凯华轴座+3528反贴灯]  15.21 118.82 0 top
SW01  凯华轴座+3528反贴灯 COPY  [凯华轴座+3528反贴灯]  34.26 118.82 0 top
SW02  凯华轴座+3528反贴灯 COPY  [凯华轴座+3528反贴灯]  53.31 118.82 0 top
SW03  凯华轴座+3528反贴灯 COPY  [凯华轴座+3528反贴灯]  72.36 118.82 0 top
SW04  凯华轴座+3528反贴灯 COPY  [凯华轴座+3528反贴灯]  91.41 118.82 0 top
SW05  凯华轴座+3528反贴灯 COPY  [凯华轴座+3528反贴灯]  115.29 118.82 0 top
SW10  凯华轴座+3528反贴灯 COPY  [凯华轴座+3528反贴灯]  15.21 99.77 0 top
SW11  凯华轴座+3528反贴灯 COPY  [凯华轴座+3528反贴灯]  34.26 99.77 0 top
SW12  凯华轴座+3528反贴灯 COPY  [凯华轴座+3528反贴灯]  53.31 99.77 0 top
SW13  凯华轴座+3528反贴灯 COPY  [凯华轴座+3528反贴灯]  72.36 99.77 0 top
SW14  凯华轴座+3528反贴灯 COPY  [凯华轴座+3528反贴灯]  91.41 99.77 0 top
SW15  凯华轴座+3528反贴灯 COPY  [凯华轴座+3528反贴灯]  110.46 99.77 0 top
SW20  凯华轴座+3528反贴灯 COPY  [凯华轴座+3528反贴灯]  15.21 80.72 0 top
SW21  凯华轴座+3528反贴灯 COPY  [凯华轴座+3528反贴灯]  34.26 80.72 0 top
SW22  凯华轴座+3528反贴灯 COPY  [凯华轴座+3528反贴灯]  53.31 80.72 0 top
SW23  凯华轴座+3528反贴灯 COPY  [凯华轴座+3528反贴灯]  72.36 80.72 0 top
SW24  凯华轴座+3528反贴灯 COPY  [凯华轴座+3528反贴灯]  91.41 80.72 0 top
SW30  凯华轴座+3528反贴灯 COPY  [凯华轴座+3528反贴灯]  15.21 52.15 0 top
SW31  凯华轴座+3528反贴灯 COPY  [凯华轴座+3528反贴灯]  34.26 61.67 0 top
SW32  凯华轴座+3528反贴灯 COPY  [凯华轴座+3528反贴灯]  53.31 61.67 0 top
SW33  凯华轴座+3528反贴灯 COPY  [凯华轴座+3528反贴灯]  72.36 61.67 0 top
SW34  凯华轴座+3528反贴灯 COPY  [凯华轴座+3528反贴灯]  91.41 61.67 0 top
SW42  凯华轴座+3528反贴灯 COPY  [凯华轴座+3528反贴灯]  43.79 42.62 0 top
SW43  凯华轴座+3528反贴灯 COPY  [凯华轴座+3528反贴灯]  72.36 42.62 0 top
SW44  凯华轴座+3528反贴灯 COPY  [凯华轴座+3528反贴灯]  91.43 42.62 0 top
SW45  TS24CA  [SW-SMD_TS24CA]  183.63 75.13 330 top
U1  CH450H  [SOP-20_L12.7-W7.5-P1.27-LS10.3-BL]  115.08 66.42 270 top
U45  PM254-2-14-Z-8.5  [HDR-TH_28P-P2.54-V-F-R2-C14-S2.54-1]  155.18 26.62 60 top
U46  PM254-2-14-Z-8.5  [HDR-TH_28P-P2.54-V-F-R2-C14-S2.54-1]  123.69 44.88 60 top

## Footprints (pads in the part's own frame, mm; a bottom-side part is the same pattern mirrored in y, then rotated)
C0805
  rect 1.41x1.35 smd: 1(-1,0) 2(1,0)
CAP-TH_BD6.0-P2.50-D0.5-FD
  round 1.5 hole 0.8: 1(-1.25,0) 2(1.25,0)
HDR-TH_2P-P2.54-V-M
  rect 2x2 hole 1.2: 1(-1.27,0)
  round 2 hole 1.2: 2(1.27,0)
HDR-TH_6P-P2.54-V-M-1
  rect 1.8x1.8 hole 1.2: 1(-6.35,0)
  round 1.8 hole 1.2: 2(-3.81,0) 3(-1.27,0) 4(1.27,0) 5(3.81,0) 6(6.35,0)
HDR-TH_28P-P2.54-V-F-R2-C14-S2.54-1
  rect 1.6x1.6 hole 1.02: 1(-16.51,-1.27)
  round 1.6 hole 1.02: 2(-16.51,1.27) 3(-13.97,-1.27) 4(-13.97,1.27) 5(-11.43,-1.27) 6(-11.43,1.27) 7(-8.89,-1.27) 8(-8.89,1.27) 9(-6.35,-1.27) 10(-6.35,1.27) 11(-3.81,-1.27) 12(-3.81,1.27) 13(-1.27,-1.27) 14(-1.27,1.27) 15(1.27,-1.27) 16(1.27,1.27) 17(3.81,-1.27) 18(3.81,1.27) 19(6.35,-1.27) 20(6.35,1.27) 21(8.89,-1.27) 22(8.89,1.27) 23(11.43,-1.27) 24(11.43,1.27) 25(13.97,-1.27) 26(13.97,1.27) 27(16.51,-1.27) 28(16.51,1.27)
HDR-TH_IPCP254M05PB08R
  rect 1.6x1.6 hole 1.05: 1(-5.08,0)
  round 1.6 hole 1.05: 2(-2.54,0) 3(0,0) 4(2.54,0) 5(5.08,0)
LED-ARRAY-SMD_4P-L2.1-W2.1-TL_NH-B2020RGBA
  rect 0.8x0.7 smd: 1(-0.85,0.55) 2(0.85,0.55) 3(0.85,-0.55) 4(-0.85,-0.55)
R0805
  rect 1.133x1.377 smd: 1(-1,0) 2(1,0)
SOD-123_L2.8-W1.8-LS3.7-RD
  rect 0.95x1.15 smd: 1(-1.692,0) 2(1.692,0)
SOP-20_L12.7-W7.5-P1.27-LS10.3-BL
  oval 0.6x2.3 smd: 1(-5.715,-4.55) 2(-4.445,-4.55) 3(-3.175,-4.55) 4(-1.905,-4.55) 5(-0.635,-4.55) 6(0.635,-4.55) 7(1.905,-4.55) 8(3.175,-4.55) 9(4.445,-4.55) 10(5.715,-4.55) 11(5.715,4.55) 12(4.445,4.55) 13(3.175,4.55) 14(1.905,4.55) 15(0.635,4.55) 16(-0.635,4.55) 17(-1.905,4.55) 18(-3.175,4.55) 19(-4.445,4.55) 20(-5.715,4.55)
SW-SMD_TS24CA
  custom 1.05x1.3 smd: 1(-2.125,0.975) 2(2.125,0.975)
  rect 0.6x1.2 smd: 3(-1.7,-0.975) 4(1.7,-0.975)
凯华轴座+3528反贴灯
  rect 1.778x0.889 smd far side: 1(2.921,4.191) 2(2.921,5.969) 5(-2.921,5.969) 6(-2.921,4.191)
  rect 2.54x2.54 smd far side: 3(-6.35,-5.08) 4(7.62,-2.54)

## Nets
As in the schematic.

Pads without a net: SW45 1 2; U1 9; U45 1 2 3 4 5 7 8 9 10 11 12 13 16 18 20 22 26; U46 1 2 3 4 6 9 10 13 15 16 17 18 21 25

## Via types
v1: diameter 0.61, hole 0.305, Top Layer to Bottom Layer, 11 vias
v2: diameter 0.62, hole 0.31, Top Layer to Bottom Layer, 66 vias

## Routing (per net, layer and track width the routed paths; a pad name or vN(x,y) marks a point on that pad's centre or on a via; arc(x,y) is an arc through that point)
3V3_1: length 43.5
  Top Layer w0.508: 162.34,41.55 SW45.3 179.35,76.61 LED4.3
3V3_2: length 56.1
  Top Layer w0.508: H3.2 H3.1 R13.2 R14.2 133.34,60.61 131.84,59.1 131.84,58.11 130.5,56.78 130.5,54.14
  Bottom Layer w0.508: R11.2 R12.2 122.86,76.16 124.45,77.75 124.45,79.7 H3.2
GND:
  vias: v2(20.4,121.43) v2(39.4,121.43) v2(57.4,83.43) v2(57.4,64.43) v2(58.4,121.43) v2(76.4,83.43) v2(76.4,64.43) v2(77.4,121.43) v2(95.4,83.43) v2(95.4,64.43) v2(96.4,121.43) v2(120.4,121.43)
VCC: length 821.1
  Top Layer w0.508: v2(86.65,86.25) 86.59,86.19 84.27,86.19 ; v2(86.65,67.2) 86.59,67.13 84.27,67.13 ; 27.12,86.19 25.44,86.19 24.74,85.49 24.74,71.2 27.12,68.82 27.12,67.13 29.44,67.13 v2(29.5,67.2) ; 27.12,86.19 29.44,86.19 v2(29.5,86.25) ; 27.12,86.19 27.12,87.87 24.74,90.25 24.74,104.54 25.44,105.24 27.12,105.24 ; 65.22,67.13 63.54,67.13 62.84,66.43 62.84,52.15 65.22,49.77 65.22,48.08 67.54,48.08 v2(67.6,48.15) ; 65.22,67.13 67.54,67.13 v2(67.6,67.2) ; 65.22,67.13 65.22,68.82 62.84,71.2 62.84,85.49 63.54,86.19 65.22,86.19 ; 65.22,124.29 63.54,124.29 62.84,123.59 62.84,109.3 65.22,106.92 65.22,105.24 ; 65.22,124.29 67.54,124.29 v2(67.6,124.35) ; 65.22,124.29 65.22,128.35 ; 8.07,86.19 10.39,86.19 v2(10.45,86.25) ; 8.07,86.19 8.07,87.87 5.69,90.25 5.69,104.53 6.39,105.24 8.07,105.24 ; 8.07,86.19 6.39,86.19 5.69,85.48 5.69,61.67 8.07,59.29 8.07,57.61 10.39,57.61 v2(10.45,57.67) ; 84.27,105.24 86.59,105.24 v2(86.65,105.3) ; 84.27,105.24 84.27,106.92 81.89,109.3 81.89,123.59 82.59,124.29 84.27,124.29 ; 84.27,105.24 82.59,105.24 81.89,104.54 81.89,90.25 84.27,87.87 84.27,86.19 ; 108.08,124.29 108.08,128.32 108.11,128.35 ; 108.08,124.29 110.34,124.29 v2(110.4,124.35) ; 108.08,124.29 104.02,124.29 103.32,123.59 103.32,105.24 105.64,105.24 v2(105.7,105.3) ; 84.27,124.29 86.59,124.29 v2(86.65,124.35) ; 84.27,124.29 84.27,128.35 ; v2(67.6,105.3) 67.54,105.24 65.22,105.24 ; v2(48.55,124.35) 48.49,124.29 46.17,124.29 ; 65.22,105.24 63.54,105.24 62.84,104.54 62.84,90.25 65.22,87.87 65.22,86.19 ; 46.17,86.19 46.17,87.87 43.79,90.25 43.79,104.54 44.49,105.24 46.17,105.24 ; 46.17,86.19 48.49,86.19 v2(48.55,86.25) ; 46.17,86.19 44.49,86.19 43.79,85.49 43.79,71.2 46.17,68.82 46.17,67.13 ; 65.22,128.35 46.17,128.35 ; 65.22,128.35 84.27,128.35 ; 46.17,128.35 46.17,124.29 ; 46.17,128.35 27.12,128.35 ; v2(10.45,105.3) 10.39,105.24 8.07,105.24 ; 119.63,61.97 117.32,61.97 116.34,62.96 C1.2 116.34,88.58 120.16,92.4 132.32,92.4 134.08,94.16 C5.1 134.08,102.83 ; 65.22,86.19 67.54,86.19 v2(67.6,86.25) ; 84.27,86.19 82.59,86.19 81.89,85.49 81.89,71.2 84.27,68.82 84.27,67.13 ; 46.17,105.24 48.49,105.24 v2(48.55,105.3) ; 46.17,105.24 46.17,106.92 43.79,109.3 43.79,123.59 44.49,124.29 46.17,124.29 ; 108.11,128.35 130.16,128.35 134.1,124.41 C2.2 C3.2 134.1,102.86 ; 108.11,128.35 84.27,128.35 ; v2(39.02,48.15) 38.96,48.08 36.64,48.08 36.64,49.77 43.79,56.91 43.79,66.43 44.49,67.13 46.17,67.13 ; 8.07,105.24 8.07,106.66 5.69,109.04 5.69,123.58 6.39,124.29 8.07,124.29 ; U46.27 137.91,63.41 137.91,100.79 135.84,102.86 C4.2 ; 84.27,67.13 82.59,67.13 81.89,66.43 81.89,52.15 84.27,49.77 84.27,48.08 86.59,48.08 v2(86.65,48.15) ; 27.12,105.24 29.44,105.24 v2(29.5,105.3) ; 27.12,105.24 27.12,106.92 24.74,109.3 24.74,123.59 25.44,124.29 27.12,124.29 ; 27.12,128.35 10.45,128.35 8.07,125.97 8.07,124.29 ; 27.12,128.35 27.12,124.29 ; 8.07,124.29 10.39,124.29 v2(10.45,124.35) ; v2(29.5,124.35) 29.44,124.29 27.12,124.29 ; 46.17,67.13 48.49,67.13 v2(48.55,67.2)
  Bottom Layer w0.508: SW04.5 87.09,124.79 v2(86.65,124.35) ; v2(10.45,124.35) 10.89,124.79 SW00.5 ; SW30.5 10.89,58.12 v2(10.45,57.67) ; v2(48.55,67.2) 48.99,67.64 SW32.5 ; SW10.5 10.89,105.74 v2(10.45,105.3) ; SW11.5 29.94,105.74 v2(29.5,105.3) ; v2(110.4,124.35) 110.84,124.79 SW05.5 ; SW01.5 29.94,124.79 v2(29.5,124.35) ; v2(67.6,67.2) 68.04,67.64 SW33.5 ; v2(48.55,124.35) 48.99,124.79 SW02.5 ; v2(105.7,105.3) 106.14,105.74 SW15.5 ; v2(86.65,48.15) 87.09,48.59 88.49,48.59 ; v2(48.55,86.25) 48.99,86.69 50.39,86.69 ; SW42.5 39.47,48.59 v2(39.02,48.15) ; v2(86.65,105.3) 87.09,105.74 SW14.5 ; SW31.5 29.94,67.64 v2(29.5,67.2) ; v2(67.6,124.35) 68.04,124.79 SW03.5 ; SW13.5 68.04,105.74 v2(67.6,105.3) ; v2(48.55,105.3) 48.99,105.74 SW12.5 ; v2(67.6,48.15) 68.04,48.59 SW43.5 ; 31.34,86.69 29.94,86.69 v2(29.5,86.25) ; v2(67.6,86.25) 68.04,86.69 69.44,86.69 ; 12.29,86.69 10.89,86.69 v2(10.45,86.25) ; v2(86.65,67.2) 87.09,67.64 SW34.5 ; v2(86.65,86.25) 87.09,86.69 88.49,86.69
(no net): length 2.3
  Top Layer w0.254: 110.53,61.97 v1(108.22,61.97)
BLUE: length 42.3
  Top Layer w0.254: R4.2 162.55,58.11 153.66,49.22 153.66,34.41 157.47,30.6 157.47,30.17 158.19,29.46 158.19,29.28
COL0: length 188.3
  Top Layer w0.254: v2(22.36,114.06) v2(22.36,95.01) v2(22.36,75.96) v2(22.36,52.15) 22.1,51.89 22.1,41.48 31.45,32.13 101.51,32.13 115.25,45.87 R5.2
  Bottom Layer w0.254: SW20.4 22.83,76.44 v2(22.36,75.96) ; SW00.4 22.83,114.54 v2(22.36,114.06) ; SW30.4 22.83,51.67 v2(22.36,52.15) ; SW10.4 22.83,95.49 v2(22.36,95.01)
COL1: length 176.4
  Top Layer w0.254: v2(41.41,56.91) v2(41.41,75.96) v2(41.41,95.01) v2(41.41,114.06) ; R6.1 102.84,42.85 95.42,35.43 31.4,35.43
  Bottom Layer w0.254: SW11.4 41.88,95.49 v2(41.41,95.01) ; v2(41.41,114.06) 41.88,114.54 SW01.4 ; v2(31.4,35.43) 30.21,36.62 30.21,49.99 37.14,56.91 v2(41.41,56.91) 41.88,57.39 SW31.4 ; SW21.4 41.88,76.44 v2(41.41,75.96)
COL2: length 155.9
  Top Layer w0.254: v2(52.46,34.44) 96.71,34.44 105.94,43.67 R7.1 ; v2(60.46,114.06) v2(60.46,95.01) v2(60.46,75.96) v2(60.46,56.91) 60.46,51.64 v2(51.44,42.62)
  Bottom Layer w0.254: v2(60.46,114.06) 60.93,114.54 SW02.4 ; SW32.4 60.93,57.39 v2(60.46,56.91) ; v2(60.46,75.96) 60.93,76.44 SW22.4 ; v2(51.44,42.62) 51.41,42.59 SW42.4 51.41,35.49 v2(52.46,34.44) ; v2(60.46,95.01) 60.93,95.49 SW12.4
COL3: length 127.9
  Top Layer w0.254: v2(79.51,45) v2(79.51,56.91) v2(79.51,75.96) v2(79.51,95.01) v2(79.51,114.06) ; v2(80.91,33.44) 97.99,33.44 109.05,44.49 R8.1
  Bottom Layer w0.254: SW13.4 79.98,95.49 v2(79.51,95.01) ; SW23.4 79.98,76.44 v2(79.51,75.96) ; SW33.4 79.98,57.39 v2(79.51,56.91) ; v2(79.51,114.06) 79.98,114.54 SW03.4 ; v2(79.51,45) 79.98,44.53 SW43.4 79.98,34.36 v2(80.91,33.44)
COL4: length 108.4
  Top Layer w0.254: v2(98.56,49.77) v2(98.56,56.91) v2(98.56,75.96) v2(98.56,95.01) v2(98.56,114.06) ; R9.1 112.15,45.05 102.32,35.23 v2(102.19,35.23)
  Bottom Layer w0.254: v2(98.56,95.01) 99.03,95.49 SW14.4 ; v2(98.56,114.06) 99.03,114.54 SW04.4 ; SW24.4 99.03,76.44 v2(98.56,75.96) ; v2(98.56,49.77) 99.03,49.29 99.03,37.3 101.11,35.23 v2(102.19,35.23) ; v2(98.56,56.91) 99.03,57.39 SW34.4
COL5: length 35.3
  Top Layer w0.254: R10.1 113.37,90.77 v2(117.61,95.01) 122.37,99.77 v2(122.37,114.06)
  Bottom Layer w0.254: SW05.4 122.91,114.6 v2(122.37,114.06) ; SW15.4 118.08,95.49 v2(117.61,95.01)
GREEN: length 37.5
  Top Layer w0.254: R3.2 173.07,63.55 158.74,49.22 158.74,39.74 161.28,37.2 161.28,36.52 161.92,35.88 U45.23
INT#: length 35.1
  Top Layer w0.254: U46.14 121.95,52.69 v1(127.5,58.24) ; v1(121.82,70.86) U1.19
  Bottom Layer w0.254: v1(121.82,70.86) 124.91,70.86 127.5,68.27 v1(127.5,58.24)
LED: length 77.3
  Bottom Layer w0.254: U45.6 139.36,26.36 114.29,26.36 110.48,30.17 110.48,44.14 103.47,51.16 98.44,51.16 95.87,48.59 SW44.2
PA8: length 60.4
  Top Layer w0.254: U45.15 154.21,27.08 151.12,30.17 H6.1
PA9: length 59.4
  Top Layer w0.254: H6.2 148.58,31.02 U45.14
PB4: length 62.6
  Top Layer w0.254: v1(131.34,77.16) R13.1 129.53,79.7 128.26,80.97 H3.3
  Bottom Layer w0.254: v1(131.34,77.16) 131.34,75.35 138.42,68.27 138.42,46.68 132.68,40.95 122.88,40.95
PB5: length 52.4
  Top Layer w0.254: 120.68,42.22 120.64,42.26 120.64,53.03 131.34,63.73 R14.1 128.26,73.35 125.72,75.89 H3.4
PB8: length 56.4
  Top Layer w0.254: SW45.4 161.53,32.71 161,31.92 159.49,31.47 U45.19
  Bottom Layer w0.254: U45.19 159.42,31.44 156.96,31.44 156.45,31.95 152.63,31.95
PB14: length 43.2
  Top Layer w0.254: U46.19 131.32,49.75 146.04,64.46 H6.3
PB15: length 43.5
  Top Layer w0.254: 125.76,51.02 128.22,51.02 128.74,50.49 130.8,50.49 143.5,63.19 H6.4
PB22: length 103.8
  Bottom Layer w0.254: H2.1 140.82,97.62 156.2,82.24 156.2,57.1 133.45,34.35 119.07,34.35
RED: length 39
  Top Layer w0.254: 160.73,33.68 160.01,34.4 160.01,35 156.2,38.81 156.2,49.22 167.81,60.83 R2.2
ROW0: length 238.2
  Top Layer w0.254: U1.10 v1(108.22,60.7)
  Bottom Layer w0.254: 63.75,130.91 82.81,130.91 ; 63.75,130.91 44.66,130.91 ; 63.75,130.91 63.75,130.91 D03.1 ; 82.81,130.91 106.67,130.91 ; 82.81,130.91 82.8,130.9 D04.1 ; 25.65,130.91 25.65,130.91 D01.1 ; 25.65,130.91 44.66,130.91 ; 25.65,130.91 10.63,130.91 6.59,126.87 6.59,124.32 ; 106.67,130.91 D05.1 ; 106.67,130.91 124.57,130.91 128.4,127.08 128.4,98.39 104.38,74.37 104.38,62.43 106.11,60.7 v1(108.22,60.7) ; 44.66,130.91 44.7,130.86 D02.1
ROW1: length 217.6
  Top Layer w0.254: U1.11 v1(121.94,60.7)
  Bottom Layer w0.254: D12.1 44.7,109.26 44.73,109.3 ; 82.82,109.3 82.8,109.28 D14.1 ; 82.82,109.3 63.79,109.3 ; 82.82,109.3 101.86,109.3 ; 63.79,109.3 44.73,109.3 ; 63.79,109.3 63.75,109.26 D13.1 ; 101.86,109.3 122.37,109.3 124.45,107.22 124.45,96.21 103.37,75.13 103.37,61.16 107,57.53 121.06,57.53 122.42,58.88 122.42,60.22 v1(121.94,60.7) ; 101.86,109.3 101.84,109.28 D15.1 ; D11.1 25.65,109.27 25.68,109.3 ; D10.1 6.6,107.7 8.2,109.3 25.68,109.3 ; 44.73,109.3 25.68,109.3
ROW2: length 169.7
  Top Layer w0.254: U1.13 v1(121.94,63.24)
  Bottom Layer w0.254: 82.81,90.25 98.92,90.25 102.38,86.78 102.38,60.11 105.99,56.51 121.06,56.51 122.95,58.4 122.95,62.22 v1(121.94,63.24) ; 82.81,90.25 63.74,90.25 ; 82.81,90.25 82.8,90.24 D24.1 ; 63.74,90.25 44.7,90.25 ; 63.74,90.25 63.75,90.23 D23.1 ; 44.7,90.25 25.64,90.25 ; 44.7,90.25 44.7,90.24 D22.1 ; 25.64,90.25 8.24,90.25 6.6,88.6 D20.1 ; 25.64,90.25 25.65,90.24 D21.1
ROW3: length 164.8
  Top Layer w0.254: U1.14 v1(121.94,64.51)
  Bottom Layer w0.254: D33.1 63.75,71.19 63.76,71.2 ; 63.76,71.2 44.7,71.2 ; 63.76,71.2 82.8,71.2 ; 44.7,71.2 D32.1 ; 44.7,71.2 25.67,71.2 ; v1(121.94,64.51) 122.06,64.51 123.97,62.61 123.97,58.14 121.32,55.49 105.48,55.49 101.59,59.38 101.59,68.53 98.92,71.2 82.8,71.2 ; 25.67,71.2 8.07,71.2 6.59,69.72 D30.1 ; 25.67,71.2 25.65,71.18 D31.1 ; 82.8,71.2 82.8,71.19 D34.1
ROW4: length 112.2
  Top Layer w0.254: U1.15 v1(121.94,65.78)
  Bottom Layer w0.254: 63.74,52.15 37.2,52.15 35.55,50.49 D42.1 ; 63.74,52.15 D43.1 ; 63.74,52.15 82.9,52.15 ; 82.9,52.15 119.24,52.15 124.98,57.89 124.98,62.86 122.06,65.78 v1(121.94,65.78) ; 82.9,52.15 82.79,52.04 D44.1
SCL1: length 110.9
  Top Layer w0.254: U1.3 v1(112.54,69.59)
  Bottom Layer w0.254: v1(112.54,69.59) 115.56,72.61 R11.1 114.29,74.16 113.02,75.43 113.02,80.97 120.64,88.59 133.85,88.59 140.96,81.48 140.96,45.41 132.07,36.52 120.36,36.52 U46.7
SDA1: length 54.5
  Top Layer w0.254: U1.4 v1(112.54,68.32)
  Bottom Layer w0.254: 118.14,37.82 118.14,48 126.18,56.03 126.18,64.01 120.64,69.54 R12.1 119.65,74.16 113.81,68.32 v1(112.54,68.32)
$1N69: length 9.9
  Bottom Layer w0.254: SW00.3 7.1,113.74 6.6,114.24 D00.2
$1N70: length 9.9
  Bottom Layer w0.254: SW01.3 26.15,113.74 25.65,114.24 D01.2
$1N71: length 9.9
  Bottom Layer w0.254: D02.2 44.7,114.24 45.2,113.74 SW02.3
$1N72: length 9.9
  Bottom Layer w0.254: SW03.3 64.25,113.74 63.75,114.24 D03.2
$1N73: length 9.9
  Bottom Layer w0.254: SW04.3 83.3,113.74 82.8,114.24 D04.2
$1N74: length 9.9
  Bottom Layer w0.254: D05.2 106.67,114.25 107.18,113.74 SW05.3
$1N77: length 9.9
  Bottom Layer w0.254: D10.2 6.6,96.48 6.59,96.47 6.59,95.2 7.1,94.69 SW10.3
$1N78: length 9.8
  Bottom Layer w0.254: D11.2 25.65,95.44 26.4,94.69 SW11.3
$1N79: length 9.9
  Bottom Layer w0.254: SW12.3 45.2,94.69 44.7,95.19 D12.2
$1N80: length 9.9
  Bottom Layer w0.254: SW13.3 64.25,94.69 63.75,95.19 D13.2
$1N81: length 9.9
  Bottom Layer w0.254: D14.2 82.8,95.19 83.3,94.69 SW14.3
$1N82: length 9.9
  Bottom Layer w0.254: SW15.3 102.35,94.69 101.84,95.2 D15.2
$1N83: length 9.9
  Bottom Layer w0.254: D20.2 6.6,76.14 7.1,75.64 SW20.3
$1N84: length 9.9
  Bottom Layer w0.254: D21.2 25.65,76.14 26.15,75.64 SW21.3
$1N85: length 9.9
  Bottom Layer w0.254: D22.2 44.7,76.14 45.2,75.64 SW22.3
$1N86: length 9.9
  Bottom Layer w0.254: SW23.3 64.25,75.64 63.75,76.14 D23.2
$1N87: length 9.9
  Bottom Layer w0.254: D24.2 82.8,76.14 83.3,75.64 SW24.3
$1N90: length 9
  Bottom Layer w0.254: D30.2 6.59,49.34 SW30.3
$1N91: length 9.9
  Bottom Layer w0.254: SW31.3 26.15,56.59 25.65,57.09 D31.2
$1N92: length 9.9
  Bottom Layer w0.254: D32.2 44.7,57.09 45.2,56.59 SW32.3
$1N95: length 9.9
  Bottom Layer w0.254: D33.2 63.75,57.09 64.25,56.59 SW33.3
$1N97: length 9.9
  Bottom Layer w0.254: SW34.3 83.3,56.59 82.8,57.09 D34.2
$1N99: length 8.7
  Bottom Layer w0.254: SW42.3 35.55,39.43 D42.2
$1N100: length 9.9
  Bottom Layer w0.254: SW43.3 64.25,37.54 63.74,38.05 D43.2
$1N101: length 9.9
  Bottom Layer w0.254: SW44.3 83.3,37.54 82.79,38.05 D44.2
$1N102: length 23.5
  Bottom Layer w0.254: 69.44,46.81 51.5,46.81 49.72,48.59 46.71,48.59
$1N103: length 13.9
  Bottom Layer w0.254: SW43.2 78.3,48.59 80.08,46.81 88.49,46.81
$1N108: length 154.8
  Bottom Layer w0.254: 40.87,46.81 39.09,46.81 38.64,46.37 38.64,45.39 39.02,45 53.31,45 55.69,42.62 55.69,35.48 50.93,30.71 39.02,30.71 34.26,35.48 34.26,51.49 37.29,54.53 98.56,54.53 100.94,56.91 100.94,64.86 98.16,67.64 94.33,67.64
$1N109: length 13.9
  Bottom Layer w0.254: SW33.2 78.3,67.64 80.08,65.86 SW34.6
$1N110: length 13.9
  Bottom Layer w0.254: 56.23,67.64 59.25,67.64 61.03,65.86 SW33.6
$1N111: length 13.9
  Bottom Layer w0.254: 37.18,67.64 40.2,67.64 41.98,65.86 SW32.6
$1N112: length 18.9
  Bottom Layer w0.254: SW30.2 20.8,58.12 22.36,59.67 22.36,63.99 24.23,65.86 SW31.6
$1N113: length 195.5
  Bottom Layer w0.254: 94.33,86.69 97.14,86.69 100.94,82.89 100.94,73.58 99.76,72.4 5.75,72.4 3.31,69.96 3.31,47.38 10.45,40.24 22.36,40.24 27.12,45 27.12,49.76 22.36,54.53 10.45,54.53 9.94,55.04 9.94,55.89 10.38,56.34 SW30.6
$1N114: length 13.9
  Bottom Layer w0.254: 88.49,84.91 80.08,84.91 78.3,86.69 75.28,86.69
$1N115: length 13.9
  Bottom Layer w0.254: 56.23,86.69 59.25,86.69 61.03,84.91 69.44,84.91
$1N116: length 13.9
  Bottom Layer w0.254: 50.39,84.91 41.98,84.91 40.2,86.69 37.18,86.69
$1N117: length 13.9
  Bottom Layer w0.254: 31.34,84.91 22.93,84.91 21.15,86.69 18.13,86.69
$1N118: length 195.1
  Bottom Layer w0.254: 113.38,105.74 117.46,105.74 119.99,103.21 119.99,94.3 117.15,91.45 5.88,91.45 4.35,89.93 4.35,74.91 5.69,73.58 22.36,73.58 24.74,75.96 24.74,80.72 22.36,83.1 10.45,83.1 9.94,83.61 9.94,84.47 10.38,84.91 12.29,84.91
$1N119: length 13.9
  Bottom Layer w0.254: SW15.6 99.13,103.96 97.35,105.74 94.33,105.74
$1N120: length 13.9
  Bottom Layer w0.254: 75.28,105.74 78.3,105.74 80.08,103.96 SW14.6
$1N121: length 13.9
  Bottom Layer w0.254: 56.23,105.74 59.25,105.74 61.03,103.96 SW13.6
$1N122: length 13.9
  Bottom Layer w0.254: 37.18,105.74 40.2,105.74 41.98,103.96 SW12.6
$1N123: length 13.9
  Bottom Layer w0.254: 18.13,105.74 21.15,105.74 22.93,103.96 SW11.6
$1N125: length 18.8
  Bottom Layer w0.254: SW05.6 99.13,123.01 97.35,124.79 SW04.2
$1N126: length 13.9
  Bottom Layer w0.254: SW03.2 78.3,124.79 80.08,123.01 SW04.6
$1N127: length 13.9
  Bottom Layer w0.254: SW02.2 59.25,124.79 61.03,123.01 SW03.6
$1N128: length 13.9
  Bottom Layer w0.254: SW02.6 41.98,123.01 40.2,124.79 SW01.2
$1N129: length 13.9
  Bottom Layer w0.254: SW00.2 21.15,124.79 22.93,123.01 SW01.6
$1N130: length 201.2
  Bottom Layer w0.254: SW05.2 123.54,124.79 125.72,122.62 125.72,113.99 123.4,111.68 7.33,111.68 4.35,108.71 4.35,93.96 5.69,92.63 22.36,92.63 24.74,95.01 24.74,99.77 22.36,102.15 10.54,102.15 10.07,102.63 10.07,103.52 10.51,103.96 SW10.6
$1N70752: length 27.7
  Top Layer w0.254: R5.1 115.25,52.48 123.43,60.65 123.43,70.81 122.12,72.13 U1.20
$1N70795: length 25.9
  Top Layer w0.254: R6.2 102.86,50.84 102.86,66.82 108.17,72.13 U1.1
$1N70838: length 24.8
  Top Layer w0.254: R7.2 105.94,55.79 103.9,57.83 103.9,66.16 108.6,70.86 U1.2
$1N70881: length 21.4
  Top Layer w0.254: R8.2 109.05,54.47 104.92,58.59 104.92,64.24 106.46,65.78 U1.6
$1N70924: length 20.1
  Top Layer w0.254: R9.2 112.15,53.39 105.91,59.64 105.91,63.19 107.22,64.51 U1.7
$1N70967: length 24.4
  Top Layer w0.254: R10.2 113.37,64.3 112.3,63.24 U1.8
$1N82980: length 14.4
  Top Layer w0.254: R2.1 167.81,72.26 173.26,77.71 LED4.1
$1N82986: length 10.3
  Top Layer w0.254: R3.1 173.07,74.98 174.7,76.61 LED4.4
$1N82993: length 22.8
  Top Layer w0.254: R4.1 162.55,70.81 171.44,79.7 176.52,79.7 177.37,78.85 LED4.2

## Copper pours and planes (outline as drawn; the poured copper is in the pictures)
GND on Top Layer: -47,167.84 219.7,167.84 219.7,-25.2 -47,-25.2
GND on Bottom Layer: -16.27,143.2 208.78,143.2 208.78,-6.66 -16.27,-6.66

Small or netless copper shapes (teardrops, artwork), in the pictures only: 5 on Top Layer, 20 on Bottom Layer

## Text on the board
Top Silkscreen Layer: MPU9250 | PB19 | PB21 | PB23 | PB1 | PB3 | PB5 | PB7 | PB18 | PB11 | PB20 | PB13 | PB22 | PB15 | PB0 | GND | PB2 | PB4 | PB6 | PB10 | PB12 | PB14 | VCC | 3V3 | 5V | PA5 | PA0 | PA2 | PA15 | PA14 | PA11 | NFC_CTR | PA9 | PA4 | PA7 | PA6 | LED0 | PA1 | PA3 | LED1 | PA13 | PA12 | PA10 | PA8 | PB9 | PB8 | PB17 | PB16 | H1 | Debug | H3 | RXD | WCH | TXD | RX | UART1 | TX | Download | SDK | SCL | NCS | H2
